# EAGLE schematic ES_Daisy_Petal_Rev5 (EAGLE 9.6.1)

## Sheet 1 of 4
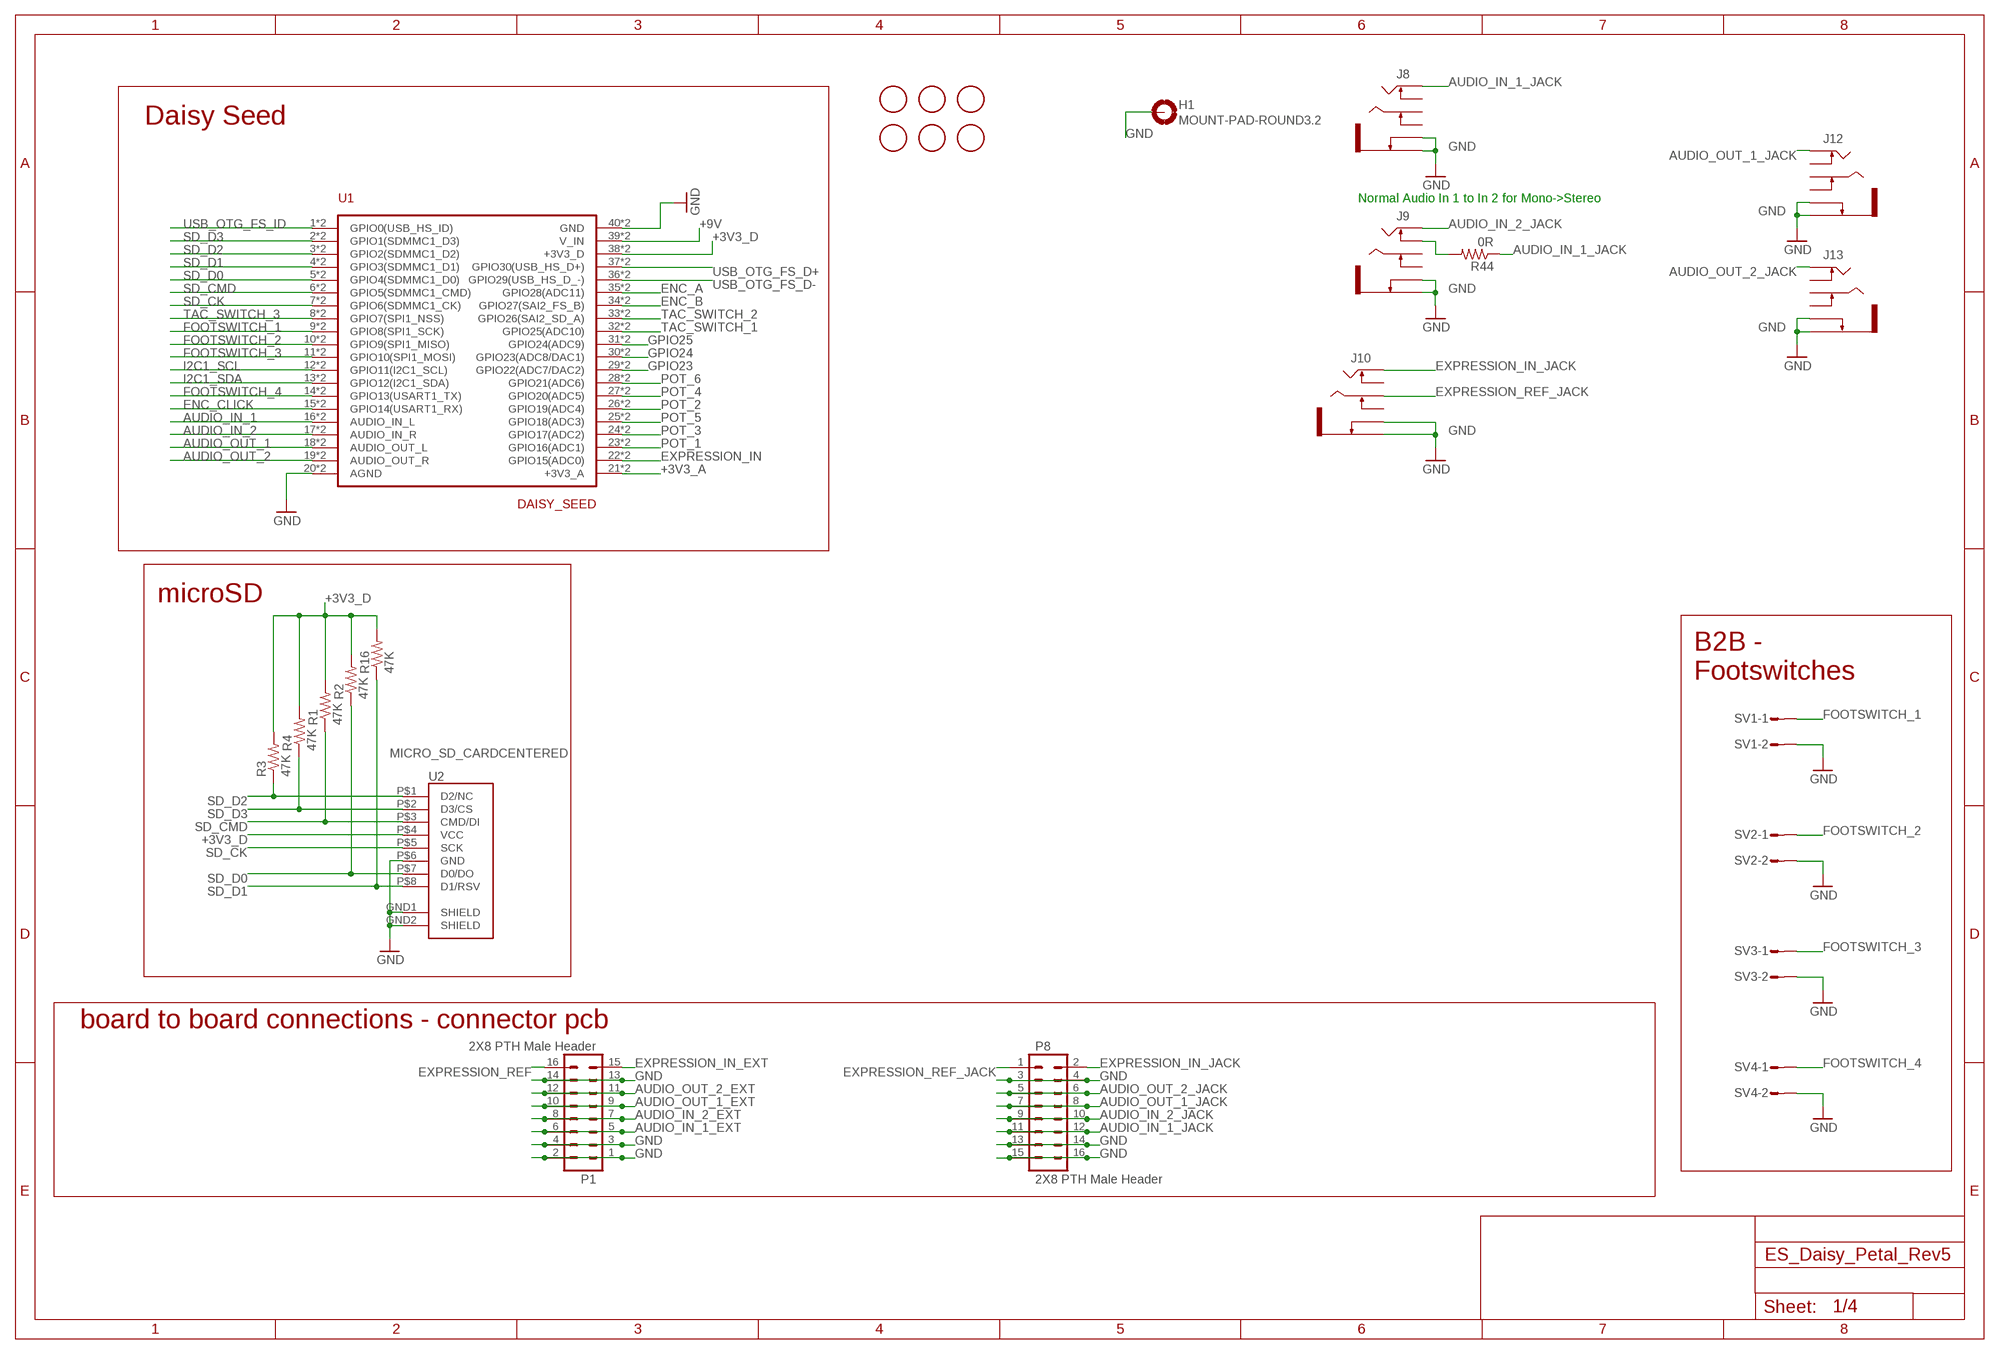
[diagram p0: schematic, sheet 1]

### Parts
FD1  FIDUCIAL  [FIDUCIAL_1MM]
FD2  FIDUCIAL  [FIDUCIAL_1MM]
FD3  FIDUCIAL  [FIDUCIAL_1MM]
FD4  FIDUCIAL  [FIDUCIAL_1MM]
FD5  FIDUCIAL  [FIDUCIAL_1MM]
FD6  FIDUCIAL  [FIDUCIAL_1MM]
H1  MOUNT-PAD-ROUND3.2  [3,2-PAD]
J8  JACK_TRS_SWITCHING_WQP-PJ6110  [WQP-PJ6110]
J9  JACK_TRS_SWITCHING_WQP-PJ6110  [WQP-PJ6110]
J10  JACK_TRS_SWITCHING_WQP-PJ6110  [WQP-PJ6110]
J12  JACK_TRS_SWITCHING_WQP-PJ6110  [WQP-PJ6110]
J13  JACK_TRS_SWITCHING_WQP-PJ6110  [WQP-PJ6110]
P1  2X8 PTH Male Header  M08X2  [2X8_SMD]
P8  2X8 PTH Male Header  M08X2_LOCK_SILK  [2X8_LOCK]
R1  47K  R-US_R0603  [R0603]
R2  47K  R-US_R0603  [R0603]
R3  47K  R-US_R0603  [R0603]
R4  47K  R-US_R0603  [R0603]
R16  47K  R-US_R0603  [R0603]
R44  0R  R-US_R0603  [R0603]
SV1  S02P  [S02P]
SV2  S02P  [S02P]
SV3  S02P  [S02P]
SV4  S02P  [S02P]
U1  DAISY_SEED  ES_DAISY_SEED_REV4_DOUBLE  [ES_DAISY_SEED_DOUBLE]
U2  MICRO_SD_CARDCENTERED  [VERT_MICROSD_CENTERED]

### Nets
+3V3_A: U1.21(+3V3_A) U1.B21(+3V3_A) ; also sheet 2
+3V3_D: R1.2 R2.2 R3.2 R4.2 R16.2 U1.38(+3V3_D) U1.B38(+3V3_D) U2.P$4(VCC) ; also sheet 2,3
+9V: U1.39(V_IN) U1.B39(V_IN) ; also sheet 4
AUDIO_IN_1: U1.16(AUDIO_IN_L) U1.B16(AUDIO_IN_L) ; also sheet 2
AUDIO_IN_1_EXT: P1.5 P1.6 ; also sheet 2
AUDIO_IN_1_JACK: J8.2(TIP) P8.11 P8.12 R44.1
AUDIO_IN_2: U1.17(AUDIO_IN_R) U1.B17(AUDIO_IN_R) ; also sheet 2
AUDIO_IN_2_EXT: P1.7 P1.8 ; also sheet 2
AUDIO_IN_2_JACK: J9.2(TIP) P8.9 P8.10
AUDIO_OUT_1: U1.18(AUDIO_OUT_L) U1.B18(AUDIO_OUT_L) ; also sheet 2
AUDIO_OUT_1_EXT: P1.9 P1.10 ; also sheet 2
AUDIO_OUT_1_JACK: J12.2(TIP) P8.7 P8.8
AUDIO_OUT_2: U1.19(AUDIO_OUT_R) U1.B19(AUDIO_OUT_R) ; also sheet 2
AUDIO_OUT_2_EXT: P1.11 P1.12 ; also sheet 2
AUDIO_OUT_2_JACK: J13.2(TIP) P8.5 P8.6
ENC_A: U1.35(GPIO28(ADC11)) U1.B35(GPIO28(ADC11)) ; also sheet 2
ENC_B: U1.34(GPIO27(SAI2_FS_B)) U1.B34(GPIO27(SAI2_FS_B)) ; also sheet 2
ENC_CLICK: U1.15(GPIO14(USART1_RX)) U1.B15(GPIO14(USART1_RX)) ; also sheet 2
EXPRESSION_IN: U1.22(GPIO15(ADC0)) U1.B22(GPIO15(ADC0)) ; also sheet 2
EXPRESSION_IN_EXT: P1.15 ; also sheet 2
EXPRESSION_IN_JACK: J10.2(TIP) P8.2
EXPRESSION_REF: P1.16 ; also sheet 2
EXPRESSION_REF_JACK: J10.3(RING) P8.1
FOOTSWITCH_1: SV1.1 U1.9(GPIO8(SPI1_SCK)) U1.B9(GPIO8(SPI1_SCK))
FOOTSWITCH_2: SV2.1 U1.10(GPIO9(SPI1_MISO)) U1.B10(GPIO9(SPI1_MISO))
FOOTSWITCH_3: SV3.1 U1.11(GPIO10(SPI1_MOSI)) U1.B11(GPIO10(SPI1_MOSI))
FOOTSWITCH_4: SV4.1 U1.14(GPIO13(USART1_TX)) U1.B14(GPIO13(USART1_TX))
GND: H1.B3,2(MOUNT) J8.1(SLEEVE) J8.4(SLEEVE_SW) J9.1(SLEEVE) J9.4(SLEEVE_SW) J10.1(SLEEVE) J10.4(SLEEVE_SW) J12.1(SLEEVE) J12.4(SLEEVE_SW) J13.1(SLEEVE) J13.4(SLEEVE_SW) P1.1 P1.2 P1.3 P1.4 P1.13 P1.14 P8.3 P8.4 P8.13 P8.14 P8.15 P8.16 SV1.2 SV2.2 SV3.2 SV4.2 U1.20(AGND) U1.40(GND) U1.B20(AGND) U1.B40(GND) U2.GND1(SHIELD) U2.GND2(SHIELD) U2.P$6(GND) ; also sheet 2,3,4
GPIO23: U1.29(GPIO22(ADC7/DAC2)) U1.B29(GPIO22(ADC7/DAC2))
GPIO24: U1.30(GPIO23(ADC8/DAC1)) U1.B30(GPIO23(ADC8/DAC1))
GPIO25: U1.31(GPIO24(ADC9)) U1.B31(GPIO24(ADC9))
I2C1_SCL: U1.12(GPIO11(I2C1_SCL)) U1.B12(GPIO11(I2C1_SCL)) ; also sheet 3
I2C1_SDA: U1.13(GPIO12(I2C1_SDA)) U1.B13(GPIO12(I2C1_SDA)) ; also sheet 3
N$22: J9.5(TIP_SW) R44.2
POT_1: U1.23(GPIO16(ADC1)) U1.B23(GPIO16(ADC1)) ; also sheet 2
POT_2: U1.26(GPIO19(ADC4)) U1.B26(GPIO19(ADC4)) ; also sheet 2
POT_3: U1.24(GPIO17(ADC2)) U1.B24(GPIO17(ADC2)) ; also sheet 2
POT_4: U1.27(GPIO20(ADC5)) U1.B27(GPIO20(ADC5)) ; also sheet 2
POT_5: U1.25(GPIO18(ADC3)) U1.B25(GPIO18(ADC3)) ; also sheet 2
POT_6: U1.28(GPIO21(ADC6)) U1.B28(GPIO21(ADC6)) ; also sheet 2
SD_CK: U1.7(GPIO6(SDMMC1_CK)) U1.B7(GPIO6(SDMMC1_CK)) U2.P$5(SCK)
SD_CMD: R1.1 U1.6(GPIO5(SDMMC1_CMD)) U1.B6(GPIO5(SDMMC1_CMD)) U2.P$3(CMD/DI)
SD_D0: R2.1 U1.5(GPIO4(SDMMC1_D0)) U1.B5(GPIO4(SDMMC1_D0)) U2.P$7(D0/DO)
SD_D1: R16.1 U1.4(GPIO3(SDMMC1_D1)) U1.B4(GPIO3(SDMMC1_D1)) U2.P$8(D1/RSV)
SD_D2: R3.1 U1.3(GPIO2(SDMMC1_D2)) U1.B3(GPIO2(SDMMC1_D2)) U2.P$1(D2/NC)
SD_D3: R4.1 U1.2(GPIO1(SDMMC1_D3)) U1.B2(GPIO1(SDMMC1_D3)) U2.P$2(D3/CS)
TAC_SWITCH_1: U1.32(GPIO25(ADC10)) U1.B32(GPIO25(ADC10)) ; also sheet 2
TAC_SWITCH_2: U1.33(GPIO26(SAI2_SD_A)) U1.B33(GPIO26(SAI2_SD_A)) ; also sheet 2
TAC_SWITCH_3: U1.8(GPIO7(SPI1_NSS)) U1.B8(GPIO7(SPI1_NSS)) ; also sheet 2
USB_OTG_FS_D+: U1.37(GPIO30(USB_HS_D+)) U1.B37(GPIO30(USB_HS_D+))
USB_OTG_FS_D-: U1.36(GPIO29(USB_HS_D_-)) U1.B36(GPIO29(USB_HS_D_-))
USB_OTG_FS_ID: U1.1(GPIO0(USB_HS_ID)) U1.B1(GPIO0(USB_HS_ID))
Unconnected: J8.3(RING) J8.5(TIP_SW) J8.6(RING_SW) J9.3(RING) J9.6(RING_SW) J10.5(TIP_SW) J10.6(RING_SW) J12.3(RING) J12.5(TIP_SW) J12.6(RING_SW) J13.3(RING) J13.5(TIP_SW) J13.6(RING_SW)

### Notes on the sheet
- Daisy Seed
- Normal Audio In 1 to In 2 for Mono->Stereo
- microSD
- B2B - 
  Footswitches
- board to board connections - connector pcb

## Sheet 2 of 4
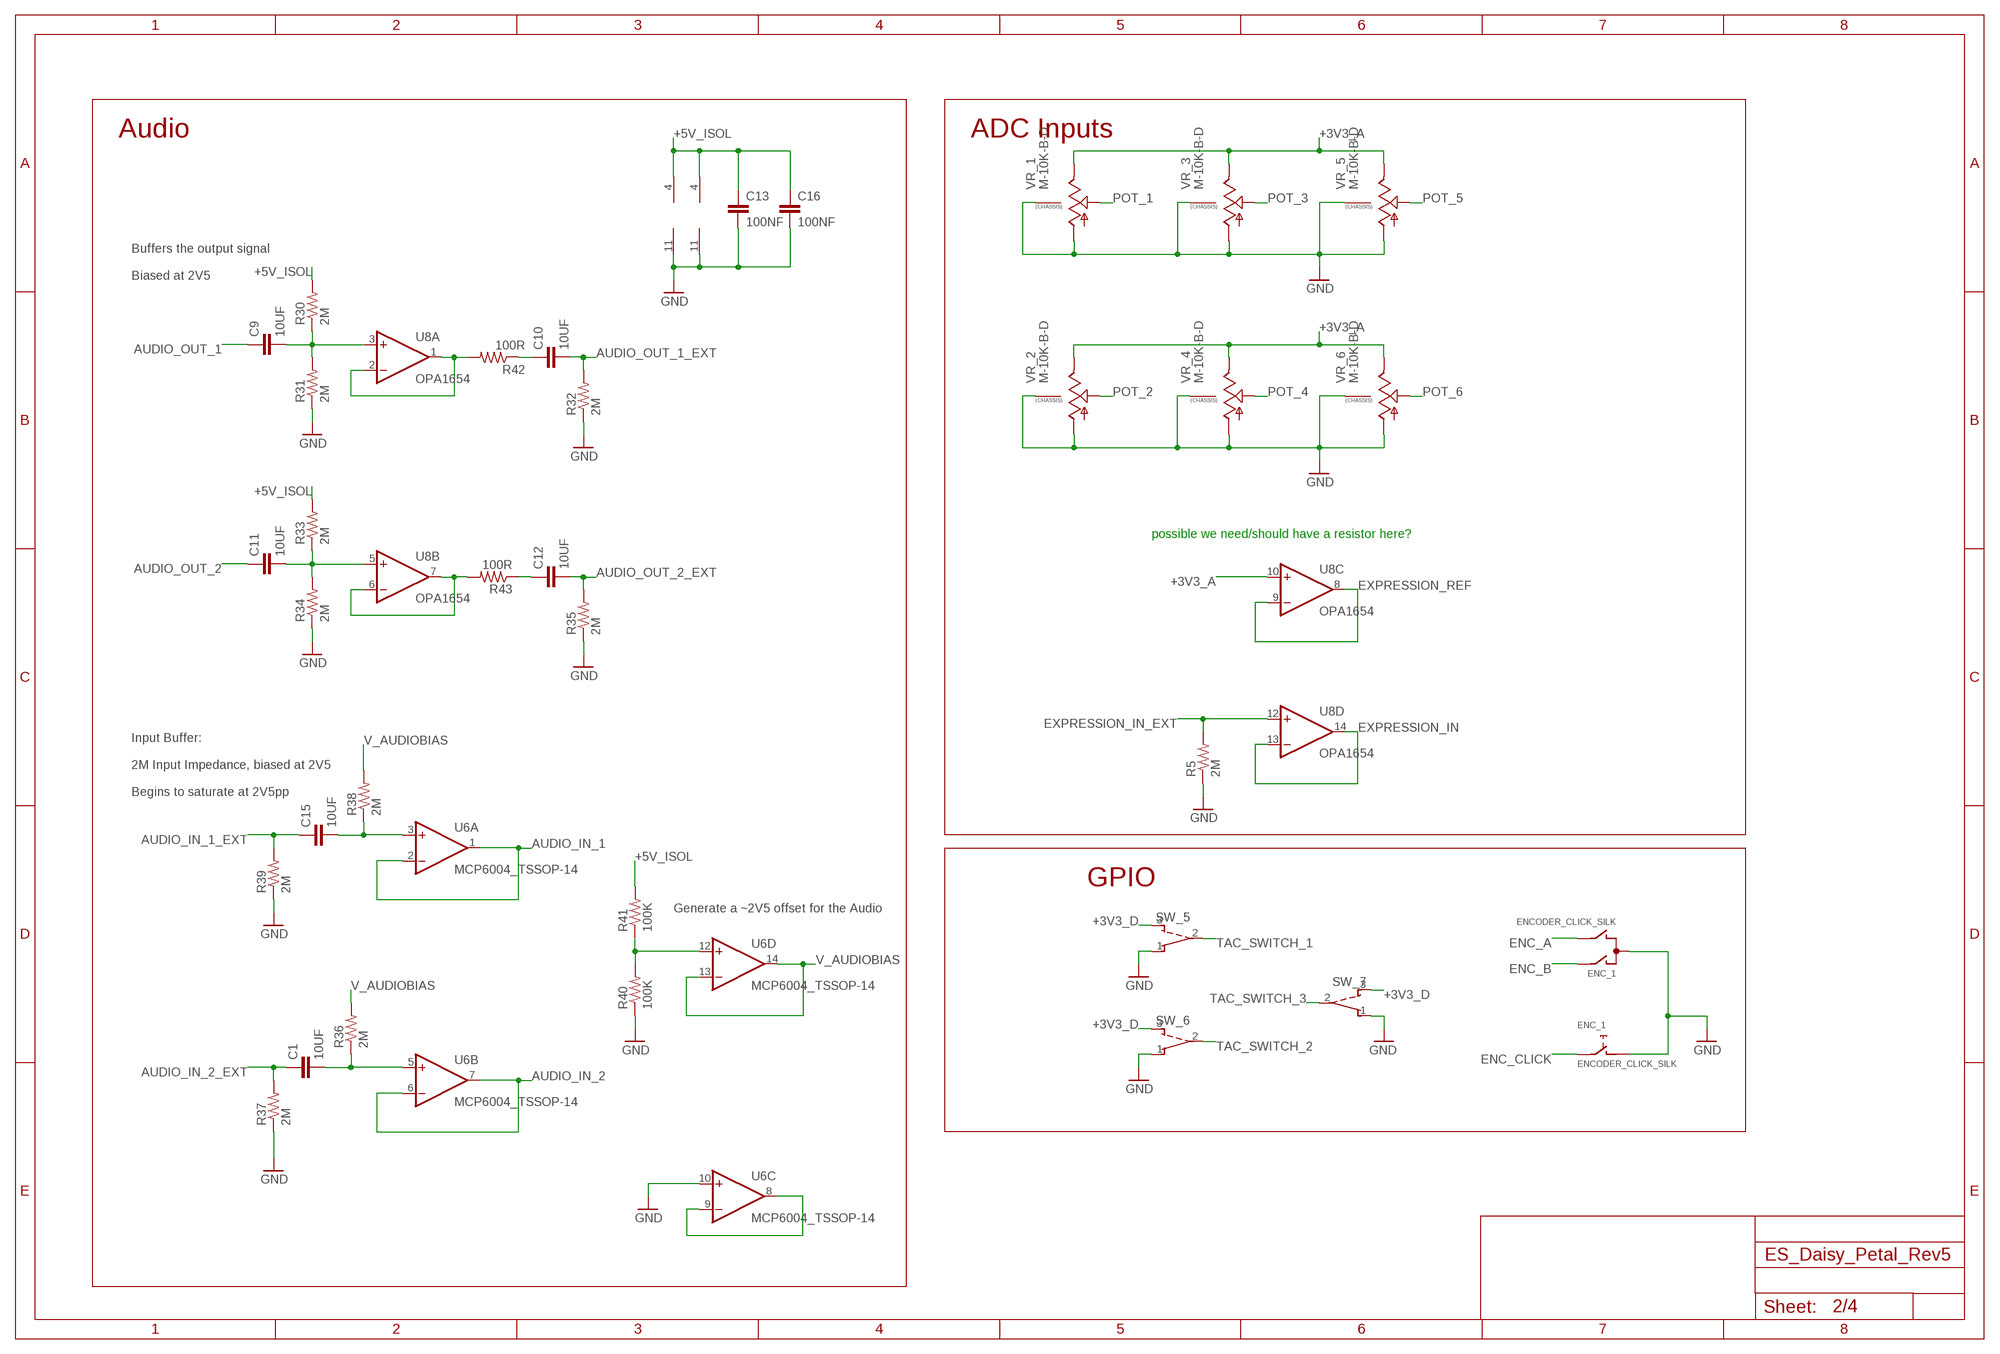
[diagram p1: schematic, sheet 2]

### Parts
C1  10UF  C-EUC0805  [C0805]
C9  10UF  C-EUC0805  [C0805]
C10  10UF  C-EUC0805  [C0805]
C11  10UF  C-EUC0805  [C0805]
C12  10UF  C-EUC0805  [C0805]
C13  100NF  C-EUC0603  [C0603]
C15  10UF  C-EUC0805  [C0805]
C16  100NF  C-EUC0603  [C0603]
ENC_1  ENCODER_CLICK_SILK  [PEC11_SILK]
R5  2M  R-US_R0603  [R0603]
R30  2M  R-US_R0603  [R0603]
R31  2M  R-US_R0603  [R0603]
R32  2M  R-US_R0603  [R0603]
R33  2M  R-US_R0603  [R0603]
R34  2M  R-US_R0603  [R0603]
R35  2M  R-US_R0603  [R0603]
R36  2M  R-US_R0603  [R0603]
R37  2M  R-US_R0603  [R0603]
R38  2M  R-US_R0603  [R0603]
R39  2M  R-US_R0603  [R0603]
R40  100K  R-US_R0603  [R0603]
R41  100K  R-US_R0603  [R0603]
R42  100R  R-US_R0603  [R0603]
R43  100R  R-US_R0603  [R0603]
SW_5  TOGGLE_ON-ON_PIN_IN_PASTE  [TOGGLE_SILK_PIP]
SW_6  TOGGLE_ON-ON_PIN_IN_PASTE  [TOGGLE_SILK_PIP]
SW_7  TOGGLE_ON-ON_PIN_IN_PASTE  [TOGGLE_SILK_PIP]
U6  MCP6004_TSSOP-14  [TSSOP-14]
U8  OPA1654  OPA1654_TSSOP-14  [TSSOP-14]
VR_1  M-10K-B-D  POT_9MM_CHASSIS_  [9MM_SNAP-IN_POT_SILK]
VR_2  M-10K-B-D  POT_9MM_CHASSIS_  [9MM_SNAP-IN_POT_SILK]
VR_3  M-10K-B-D  POT_9MM_CHASSIS_  [9MM_SNAP-IN_POT_SILK]
VR_4  M-10K-B-D  POT_9MM_CHASSIS_  [9MM_SNAP-IN_POT_SILK]
VR_5  M-10K-B-D  POT_9MM_CHASSIS_  [9MM_SNAP-IN_POT_SILK]
VR_6  M-10K-B-D  POT_9MM_CHASSIS_  [9MM_SNAP-IN_POT_SILK]

### Nets
+3V3_A: U8.10(C:+IN) VR_1.3(E) VR_2.3(E) VR_3.3(E) VR_4.3(E) VR_5.3(E) VR_6.3(E) ; also sheet 1
+3V3_D: SW_5.3(S) SW_6.3(S) SW_7.3(S) ; also sheet 1,3
+5V_ISOL: C13.1 C16.1 R30.2 R33.2 R41.2 U6.4(P:V+) U8.4(P:V+) ; also sheet 4
AUDIO_IN_1: U6.1(A:OUT) U6.2(A:-IN) ; also sheet 1
AUDIO_IN_1_EXT: C15.1 R39.2 ; also sheet 1
AUDIO_IN_2: U6.6(B:-IN) U6.7(B:OUT) ; also sheet 1
AUDIO_IN_2_EXT: C1.1 R37.2 ; also sheet 1
AUDIO_OUT_1: C9.1 ; also sheet 1
AUDIO_OUT_1_EXT: C10.2 R32.2 ; also sheet 1
AUDIO_OUT_2: C11.1 ; also sheet 1
AUDIO_OUT_2_EXT: C12.2 R35.2 ; also sheet 1
ENC_A: ENC_1.B ; also sheet 1
ENC_B: ENC_1.A ; also sheet 1
ENC_CLICK: ENC_1.E ; also sheet 1
EXPRESSION_IN: U8.13(D:-IN) U8.14(D:OUT) ; also sheet 1
EXPRESSION_IN_EXT: R5.2 U8.12(D:+IN) ; also sheet 1
EXPRESSION_REF: U8.8(C:OUT) U8.9(C:-IN) ; also sheet 1
GND: C13.2 C16.2 ENC_1.C ENC_1.D R5.1 R31.1 R32.1 R34.1 R35.1 R37.1 R39.1 R40.1 SW_5.1(O) SW_6.1(O) SW_7.1(O) U6.10(C:+IN) U6.11(P:V-) U8.11(P:V-) VR_1.1(A) VR_1.CHASSIS1(CHASSIS) VR_1.CHASSIS2(CHASSIS) VR_2.1(A) VR_2.CHASSIS1(CHASSIS) VR_2.CHASSIS2(CHASSIS) VR_3.1(A) VR_3.CHASSIS1(CHASSIS) VR_3.CHASSIS2(CHASSIS) VR_4.1(A) VR_4.CHASSIS1(CHASSIS) VR_4.CHASSIS2(CHASSIS) VR_5.1(A) VR_5.CHASSIS1(CHASSIS) VR_5.CHASSIS2(CHASSIS) VR_6.1(A) VR_6.CHASSIS1(CHASSIS) VR_6.CHASSIS2(CHASSIS) ; also sheet 1,3,4
N$2: C10.1 R42.1
N$3: C15.2 R38.1 U6.3(A:+IN)
N$5: C1.2 R36.1 U6.5(B:+IN)
N$8: U6.8(C:OUT) U6.9(C:-IN)
N$10: C12.1 R43.1
N$11: R40.2 R41.1 U6.12(D:+IN)
N$13: C9.2 R30.1 R31.2 U8.3(A:+IN)
N$19: R42.2 U8.1(A:OUT) U8.2(A:-IN)
N$20: C11.2 R33.1 R34.2 U8.5(B:+IN)
N$21: R43.2 U8.6(B:-IN) U8.7(B:OUT)
POT_1: VR_1.2(S) ; also sheet 1
POT_2: VR_2.2(S) ; also sheet 1
POT_3: VR_3.2(S) ; also sheet 1
POT_4: VR_4.2(S) ; also sheet 1
POT_5: VR_5.2(S) ; also sheet 1
POT_6: VR_6.2(S) ; also sheet 1
TAC_SWITCH_1: SW_5.2(P) ; also sheet 1
TAC_SWITCH_2: SW_6.2(P) ; also sheet 1
TAC_SWITCH_3: SW_7.2(P) ; also sheet 1
V_AUDIOBIAS: R36.2 R38.2 U6.13(D:-IN) U6.14(D:OUT)
Unconnected: ENC_1.GND1(G) ENC_1.GND2(G)

### Notes on the sheet
- Audio | ADC Inputs
- Buffers the output signal
  
  Biased at 2V5
- possible we need/should have a resistor here?
- Input Buffer:
  
  2M Input Impedance, biased at 2V5
  
  Begins to saturate at 2V5pp
- GPIO
- Generate a ~2V5 offset for the Audio

## Sheet 3 of 4
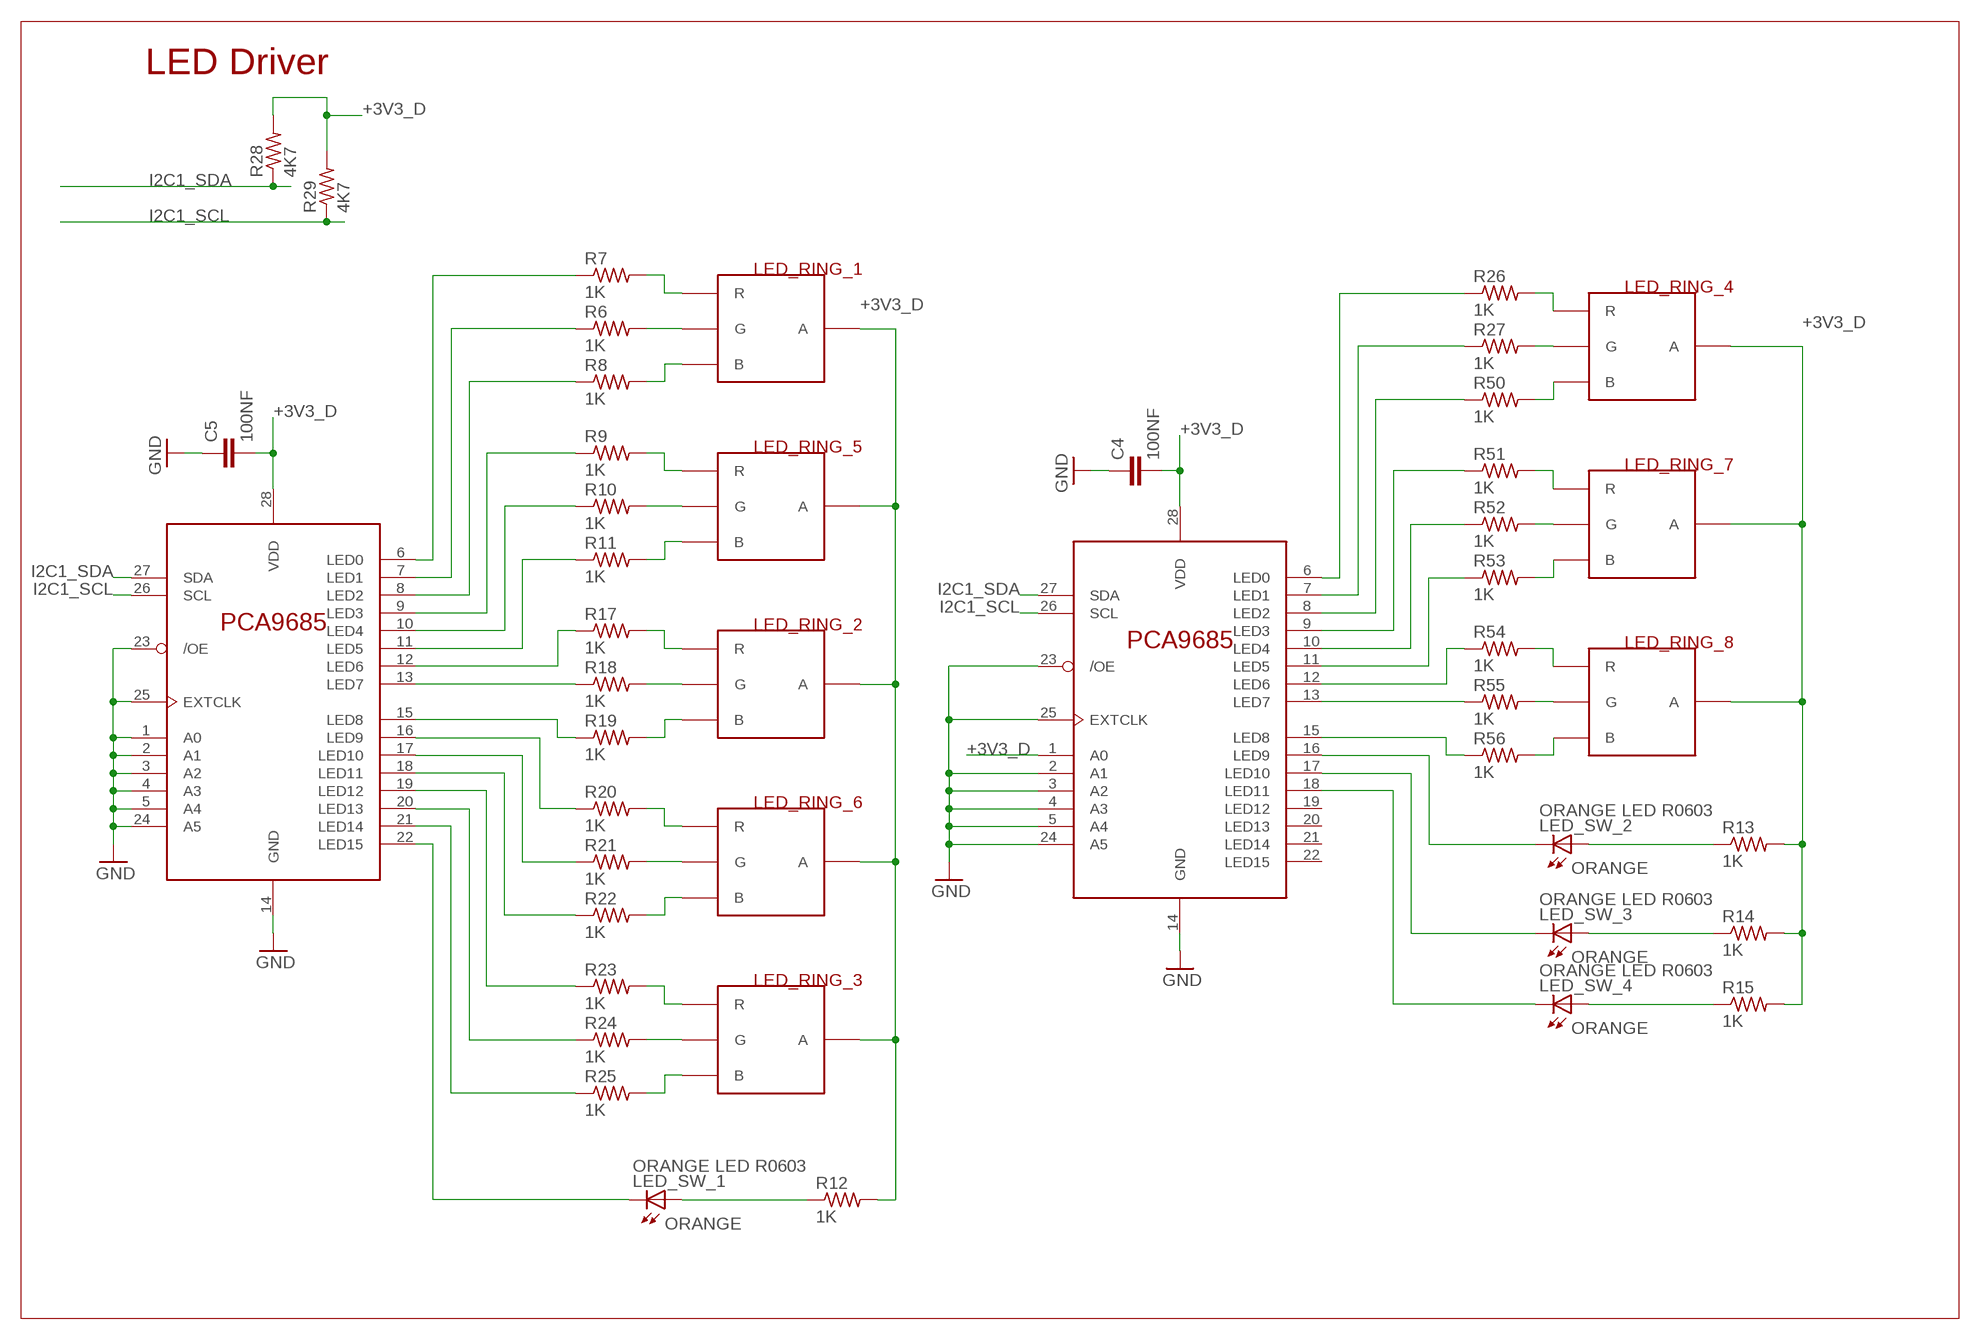
[diagram p2: schematic, sheet 3]

### Parts
C4  100NF  C-EUC0603  [C0603]
C5  100NF  C-EUC0603  [C0603]
LED_RING_1  RGB LED SMT PLCC4  LED_RGB_SMT  [P-LCC-4-3]
LED_RING_2  RGB LED SMT PLCC4  LED_RGB_SMT  [P-LCC-4-3]
LED_RING_3  RGB LED SMT PLCC4  LED_RGB_SMT  [P-LCC-4-3]
LED_RING_4  RGB LED SMT PLCC4  LED_RGB_SMT  [P-LCC-4-3]
LED_RING_5  RGB LED SMT PLCC4  LED_RGB_SMT  [P-LCC-4-3]
LED_RING_6  RGB LED SMT PLCC4  LED_RGB_SMT  [P-LCC-4-3]
LED_RING_7  RGB LED SMT PLCC4  LED_RGB_SMT  [P-LCC-4-3]
LED_RING_8  RGB LED SMT PLCC4  LED_RGB_SMT  [P-LCC-4-3]
LED_SW_1  ORANGE LED R0603  LED_ORANGE_0603  [DIODE_0603]
LED_SW_2  ORANGE LED R0603  LED_ORANGE_0603  [DIODE_0603]
LED_SW_3  ORANGE LED R0603  LED_ORANGE_0603  [DIODE_0603]
LED_SW_4  ORANGE LED R0603  LED_ORANGE_0603  [DIODE_0603]
R6  1K  R-US_R0603  [R0603]
R7  1K  R-US_R0603  [R0603]
R8  1K  R-US_R0603  [R0603]
R9  1K  R-US_R0603  [R0603]
R10  1K  R-US_R0603  [R0603]
R11  1K  R-US_R0603  [R0603]
R12  1K  R-US_R0603  [R0603]
R13  1K  R-US_R0603  [R0603]
R14  1K  R-US_R0603  [R0603]
R15  1K  R-US_R0603  [R0603]
R17  1K  R-US_R0603  [R0603]
R18  1K  R-US_R0603  [R0603]
R19  1K  R-US_R0603  [R0603]
R20  1K  R-US_R0603  [R0603]
R21  1K  R-US_R0603  [R0603]
R22  1K  R-US_R0603  [R0603]
R23  1K  R-US_R0603  [R0603]
R24  1K  R-US_R0603  [R0603]
R25  1K  R-US_R0603  [R0603]
R26  1K  R-US_R0603  [R0603]
R27  1K  R-US_R0603  [R0603]
R28  4K7  R-US_R0603  [R0603]
R29  4K7  R-US_R0603  [R0603]
R50  1K  R-US_R0603  [R0603]
R51  1K  R-US_R0603  [R0603]
R52  1K  R-US_R0603  [R0603]
R53  1K  R-US_R0603  [R0603]
R54  1K  R-US_R0603  [R0603]
R55  1K  R-US_R0603  [R0603]
R56  1K  R-US_R0603  [R0603]
U3  PCA9685PW  [TSSOP-28]
U4  PCA9685PW  [TSSOP-28]

### Nets
+3V3_D: C4.2 C5.2 LED_RING_1.2(A) LED_RING_2.2(A) LED_RING_3.2(A) LED_RING_4.2(A) LED_RING_5.2(A) LED_RING_6.2(A) LED_RING_7.2(A) LED_RING_8.2(A) R12.2 R13.2 R14.2 R15.2 R28.2 R29.2 U3.1(A0) U3.28(VDD) U4.28(VDD) ; also sheet 1,2
GND: C4.1 C5.1 U3.2(A1) U3.3(A2) U3.4(A3) U3.5(A4) U3.14(GND) U3.23(/OE) U3.24(A5) U3.25(EXTCLK) U4.1(A0) U4.2(A1) U4.3(A2) U4.4(A3) U4.5(A4) U4.14(GND) U4.23(/OE) U4.24(A5) U4.25(EXTCLK) ; also sheet 1,2,4
I2C1_SCL: R29.1 U3.26(SCL) U4.26(SCL) ; also sheet 1
I2C1_SDA: R28.1 U3.27(SDA) U4.27(SDA) ; also sheet 1
N$1: LED_SW_2.ANODE(A) R13.1
N$7: LED_RING_1.1(R) R7.2
N$9: LED_RING_1.4(G) R6.2
N$12: LED_SW_3.ANODE(A) R14.1
N$14: LED_SW_4.ANODE(A) R15.1
N$15: LED_SW_4.CATHODE(C) U3.18(LED11)
N$16: LED_RING_1.3(B) R8.2
N$17: LED_RING_5.1(R) R9.2
N$18: LED_RING_5.4(G) R10.2
N$23: LED_RING_5.3(B) R11.2
N$24: LED_RING_2.1(R) R17.2
N$25: LED_RING_2.4(G) R18.2
N$26: LED_RING_2.3(B) R19.2
N$27: LED_RING_6.1(R) R20.2
N$28: LED_RING_6.4(G) R21.2
N$29: LED_RING_6.3(B) R22.2
N$30: LED_RING_3.1(R) R23.2
N$31: LED_RING_3.4(G) R24.2
N$32: LED_RING_3.3(B) R25.2
N$33: R7.1 U4.6(LED0)
N$34: R25.1 U4.21(LED14)
N$35: R6.1 U4.7(LED1)
N$36: R8.1 U4.8(LED2)
N$37: R9.1 U4.9(LED3)
N$38: R10.1 U4.10(LED4)
N$39: R11.1 U4.11(LED5)
N$40: R17.1 U4.12(LED6)
N$41: R18.1 U4.13(LED7)
N$42: R19.1 U4.15(LED8)
N$43: R24.1 U4.20(LED13)
N$44: R23.1 U4.19(LED12)
N$45: R22.1 U4.18(LED11)
N$46: R21.1 U4.17(LED10)
N$47: R20.1 U4.16(LED9)
N$49: R26.1 U3.6(LED0)
N$50: R27.1 U3.7(LED1)
N$51: R50.1 U3.8(LED2)
N$52: R51.1 U3.9(LED3)
N$53: LED_SW_1.ANODE(A) R12.1
N$54: R52.1 U3.10(LED4)
N$55: R53.1 U3.11(LED5)
N$56: R54.1 U3.12(LED6)
N$57: R55.1 U3.13(LED7)
N$58: R56.1 U3.15(LED8)
N$63: LED_SW_3.CATHODE(C) U3.17(LED10)
N$64: LED_SW_2.CATHODE(C) U3.16(LED9)
N$65: LED_RING_8.4(G) R55.2
N$66: LED_SW_1.CATHODE(C) U4.22(LED15)
N$67: LED_RING_8.1(R) R54.2
N$68: LED_RING_8.3(B) R56.2
N$69: LED_RING_7.3(B) R53.2
N$70: LED_RING_7.4(G) R52.2
N$71: LED_RING_7.1(R) R51.2
N$72: LED_RING_4.3(B) R50.2
N$73: LED_RING_4.4(G) R27.2
N$74: LED_RING_4.1(R) R26.2
Unconnected: U3.19(LED12) U3.20(LED13) U3.21(LED14) U3.22(LED15)

### Notes on the sheet
- LED Driver

## Sheet 4 of 4
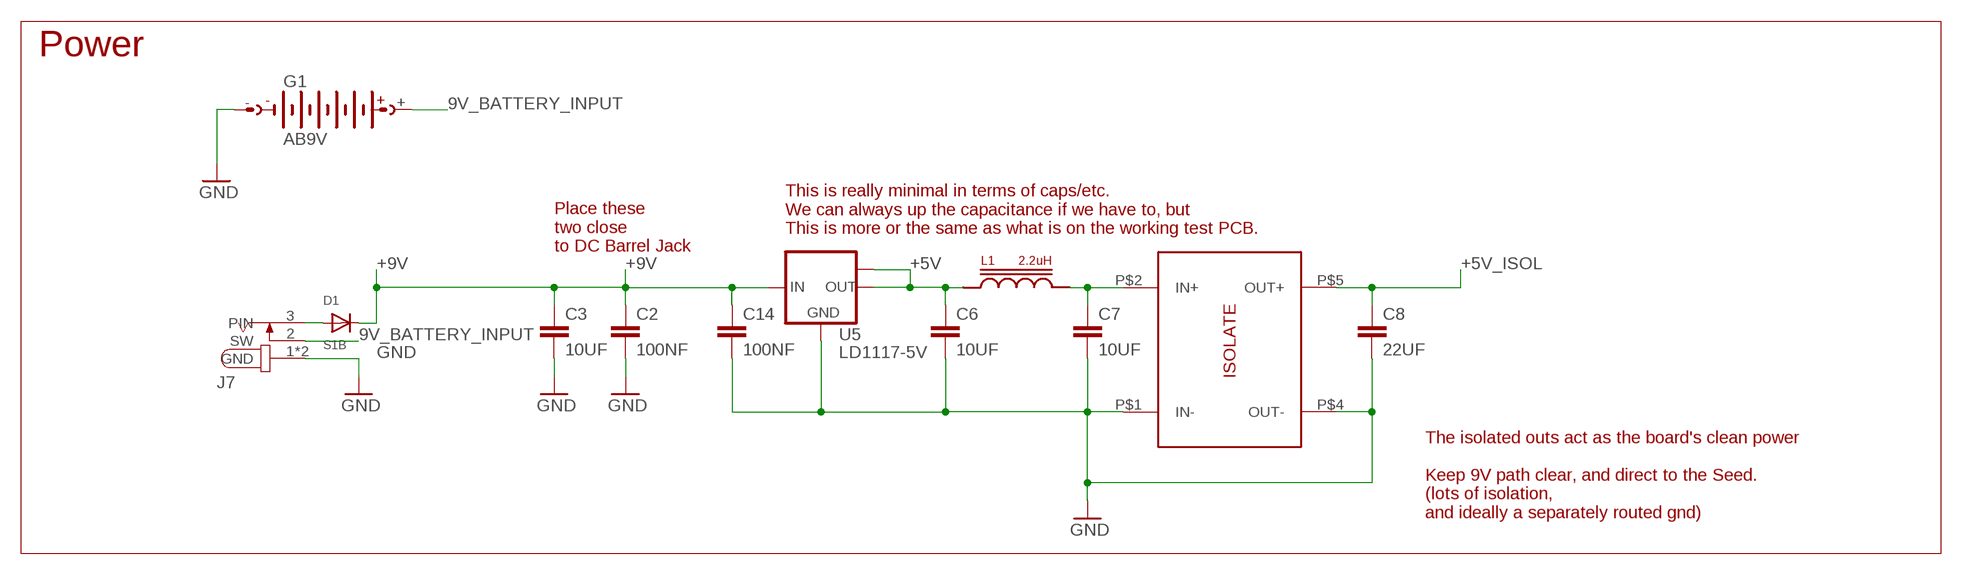
[diagram p3: schematic, sheet 4]

### Parts
C2  100NF  C-EUC0603  [C0603]
C3  10UF  C-EUC0805  [C0805]
C6  10UF  C-EUC0805  [C0805]
C7  10UF  C-EUC0805  [C0805]
C8  22UF  C-EUC1206  [C1206]
C14  100NF  C-EUC0603  [C0603]
D1  S1B  [SMADIODE]
G1  AB9V  [AB9V]
J7  GUITAR_DC_JACK  [WQP-DC0500]
L1  2.2uH  INDUCTORS  [BOURNS_SRP2010]
U5  LD1117-5V  [SOT223]
U$3  POWER_ISOLATE  [XP_POWER_ISEXXXXA]

### Nets
9V_BATTERY_INPUT: G1.+ J7.2(SW)
+5V: C6.1 L1.P$1 U5.2(OUT) U5.TAB(OUT1)
+5V_ISOL: C8.1 U$3.P$5(OUT+) ; also sheet 2
+9V: C2.1 C3.1 C14.1 D1.C U5.3(IN) ; also sheet 1
GND: C2.2 C3.2 C6.2 C7.2 C8.2 C14.2 G1.- J7.1(GND) J7.4(GND) U5.1(GND) U$3.P$1(IN-) U$3.P$4(OUT-) ; also sheet 1,2,3
N$4: C7.1 L1.P$2 U$3.P$2(IN+)
N$6: D1.A J7.3(PIN)

### Notes on the sheet
- Power
- This is really minimal in terms of caps/etc. 
  We can always up the capacitance if we have to, but
  This is more or the same as what is on the working test PCB.
- Place these 
  two close 
  to DC Barrel Jack
- The isolated outs act as the board's clean power
  
  Keep 9V path clear, and direct to the Seed. 
  (lots of isolation, 
  and ideally a separately routed gnd)

## Library data of the parts
C1 C3 C6 C7 C9-C12 C15 = Electrosmith-Passives:C-EU: CAPACITOR, European symbol; PACKAGE: C0805
C2 C4 C5 C13 C14 C16 = Electrosmith-Passives:C-EU: CAPACITOR, European symbol; PACKAGE: C0603
C8 = Electrosmith-Passives:C-EU: CAPACITOR, European symbol; PACKAGE: C1206
D1 = Electrosmith-Semiconductors:S1B; BIN#: 12-006; IPN: S1B; MPN: S1B; PACKAGE: SMA
ENC_1 = Electrosmith-Interface:ENCODER: ALPS rotary Encoder EC12E series with switch
FD1-FD6 = Electrosmith-Connectors:FIDUCIAL: For use by pick and place machines to calibrate the vision/machine, 1mm By microbuilder.eu
G1 = battery:AB9V: 9-V BATTERY CLIP
H1 = holes:MOUNT-PAD-ROUND: MOUNTING PAD, round
J7 = Electrosmith-Connectors:GUITAR_DC_JACK
J8-J10 J12 J13 = Electrosmith-Interface:JACK_TRS_SWITCHING
L1 = Electrosmith-Passives:INDUCTOR
LED_RING_1-LED_RING_8 = Electrosmith-Interface:LED_RGB_SMT; BIN#: 8-001; IPN: RGB LED SMT PLCC4; MPN: CLVBA-FKA-CC1F1L1BB7R3R3; PACKAGE: PLCC4
LED_SW_1-LED_SW_4 = Electrosmith-Interface:LED; COLOR: ORANGE; MPN: APT1608LSECK/J4-PRV
P1 = Electrosmith-Connectors:M08X2?; LABEL: TO JACK PCB
P8 = Electrosmith-Connectors:M08X2?; LABEL: solder on this side
R1-R44 R50-R56 = Electrosmith-Passives:R-US_: RESISTOR, American symbol; PACKAGE: R0603
SV1-SV4 = con-amp-mt:S02P: AMP MT CONNECTOR; OC_FARNELL: unknown; OC_NEWARK: unknown
SW_5-SW_7 = Electrosmith-Interface:TOGGLE_ON-ON
U1 = Electrosmith-Boards:ES_DAISY_SEED_REV4
U2 = Electrosmith-Interface:MICRO_SD_CARD
U3 U4 = Electrosmith-IC:PCA9685; BIN#: 16-016; IPN: PCA9685 TSSOP-28; MPN: PCA9685PW,118; PACKAGE: TSSOP-28
U5 = Electrosmith-Power:LD1117; BIN#: 12-025; IPN: LD1117-5V; MPN: LD1117S50CTR; PACKAGE: SOT-223
U6 = Electrosmith-IC:MCP6004; BIN#: N/A; IPN: MCP6004 TSSOP-14; MPN: MCP6004T-E/ST; PACKAGE: TSSOP-14
U8 = Electrosmith-IC:OPA1654: OP AMP
U$3 = Electrosmith-IC:POWER_ISOLATE; MPN: ISE2405A
VR_1-VR_6 = Electrosmith-Interface:POT_9MM_CHASSIS: 9mm vertical snap-in pot, Alpha / Panasonic style

## Net classes
0 DEFAULT: width 0.102 mm, drill 0.2 mm, clearance 0.102 mm
1 POWER: width 0.102 mm, drill 0.2 mm, clearance 0.102 mm